# EAGLE design AnalogShield-03 (EAGLE 7.2.0)
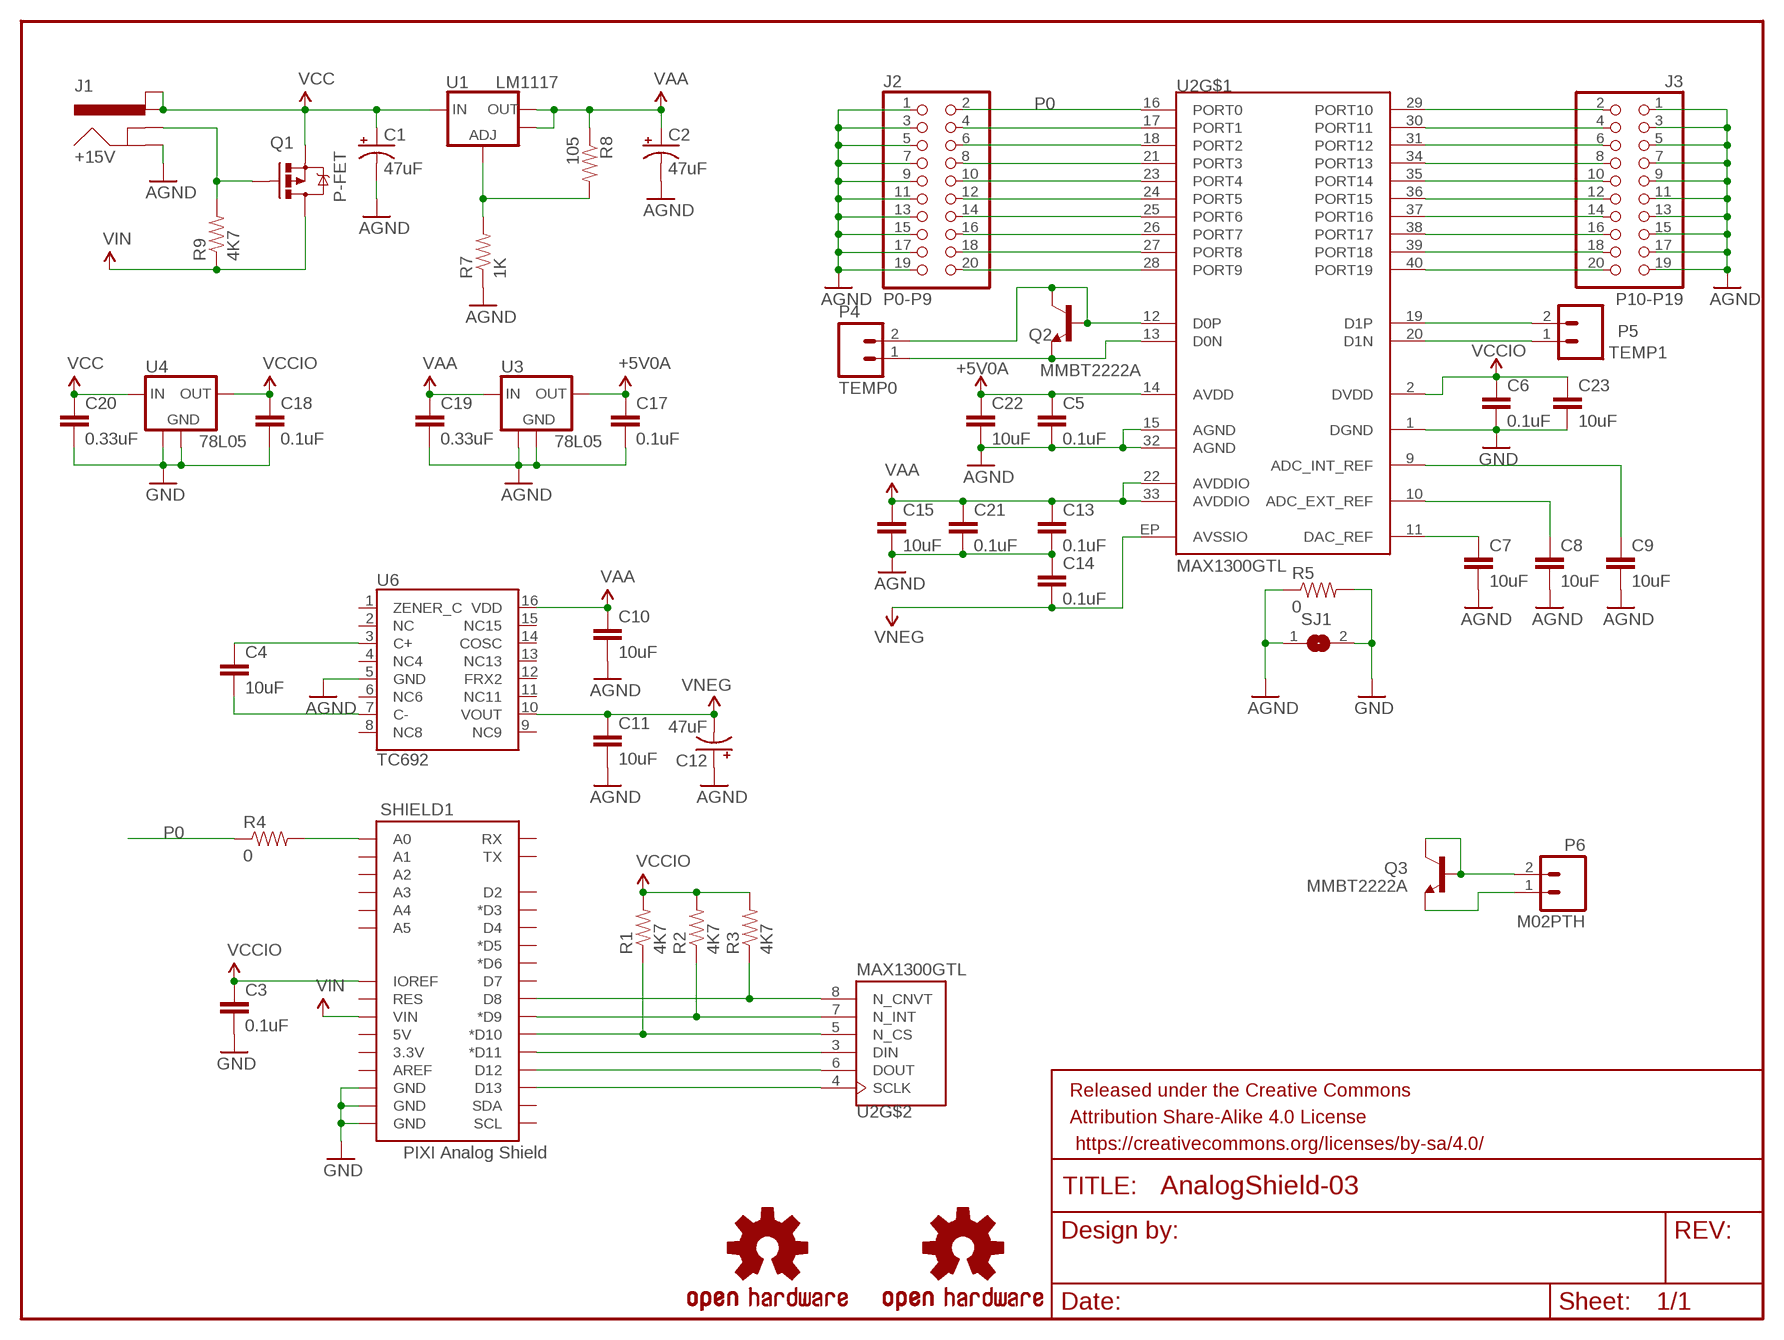
[diagram p0: schematic, sheet 1]

## Parts
C1  47uF  47UF-50V-20%(ELECT)  [PANASONIC_D]
C2  47uF  47UF-50V-20%(ELECT)  [PANASONIC_D]
C3  0.1uF  0.1UF-25V(+80/-20%)(0603)  [0603-CAP]
C4  10uF  10UF-25V-10%(1206)  [1206]
C5  0.1uF  0.1UF-25V(+80/-20%)(0603)  [0603-CAP]
C6  0.1uF  0.1UF-25V(+80/-20%)(0603)  [0603-CAP]
C7  10uF  10UF-25V-10%(1206)  [1206]
C8  10uF  10UF-25V-10%(1206)  [1206]
C9  10uF  10UF-25V-10%(1206)  [1206]
C10  10uF  10UF-25V-10%(1206)  [1206]
C11  10uF  10UF-25V-10%(1206)  [1206]
C12  47uF  47UF-50V-20%(ELECT)  [PANASONIC_D]
C13  0.1uF  0.1UF-25V(+80/-20%)(0603)  [0603-CAP]
C14  0.1uF  0.1UF-25V(+80/-20%)(0603)  [0603-CAP]
C15  10uF  10UF-25V-10%(1206)  [1206]
C17  0.1uF  0.1UF-25V(+80/-20%)(0603)  [0603-CAP]
C18  0.1uF  0.1UF-25V(+80/-20%)(0603)  [0603-CAP]
C19  0.33uF  0.33UF-25V(+20/-20%)(0603)  [0603-CAP]
C20  0.33uF  0.33UF-25V(+20/-20%)(0603)  [0603-CAP]
C21  0.1uF  0.1UF-25V(+80/-20%)(0603)  [0603-CAP]
C22  10uF  10UF-25V-10%(1206)  [1206]
C23  10uF  10UF-25V-10%(1206)  [1206]
FRAME1  FRAME-LETTER  [CREATIVE_COMMONS]
J1  +15V  POWER_JACKSMD  [POWER_JACK_SMD]
J2  P0-P9  PINHD-2X10_SMD  [2X10_SMD]
J3  P10-P19  PINHD-2X10_SMD  [2X10_SMD]
LOGO1  OSHW-LOGOS  [OSHW-LOGO-S]
LOGO2  OSHW-LOGOS  [OSHW-LOGO-S]
P4  TEMP0  M02PTH  [1X02]
P5  TEMP1  M024UCON-15767  [JST-2-SMD-VERT]
P6  M02PTH  [1X02]
Q1  P-FET  [SOT23-3]
Q2  MMBT2222A  TRANSISTOR_NPNMMBT2222A  [SOT23-3]
Q3  MMBT2222A  TRANSISTOR_NPNMMBT2222A  [SOT23-3]
R1  4K7  4.7KOHM1/10W1%(0603)  [0603]
R2  4K7  4.7KOHM1/10W1%(0603)  [0603]
R3  4K7  4.7KOHM1/10W1%(0603)  [0603]
R4  0  0OHM-1/10W-5%(0603)  [0603]
R5  0  0OHM-1/10W-5%(0603)  [0603]
R7  1K  1KOHM-1/10W-1%(0603)  [0603-RES]
R8  105  105OHM-1/10W-1%(0603)  [0603-RES]
R9  4K7  4.7KOHM1/10W1%(0603)  [0603]
SHIELD1  PIXI Analog Shield  ARDUINO_R3_SHIELDNOLABELS  [UNO_R3_SHIELD_NOLABELS]
SJ1  SJ  [SJ]
U1  LM1117  V_REG_LM1117SOT223  [SOT223]
U2  MAX1300GTL  MAX11300GTL  [QFN50P600X600X75-41]
U3  78L05  [SOT89]
U4  78L05  [SOT89]
U6  TC692  TC962COE  [SO16L]

## Nets
+5V0A: C5.1 C17.1 C22.1 U2.14(AVDD) U3.1(OUT)
ADJ: R7.2 R8.2 U1.1(ADJ)
AGND: C1.- C2.- C5.2 C7.2 C8.2 C9.2 C10.2 C11.2 C12.+ C13.2 C14.1 C15.2 C17.2 C19.2 C21.2 C22.2 J1.GND J2.1 J2.3 J2.5 J2.7 J2.9 J2.11 J2.13 J2.15 J2.17 J2.19 J3.1 J3.3 J3.5 J3.7 J3.9 J3.11 J3.13 J3.15 J3.17 J3.19 R5.1 R7.1 SJ1.1 U2.15(AGND) U2.32(AGND) U3.2(GND) U3.4(GND) U6.5(GND)
C+: C4.1 U6.3(C+)
C-: C4.2 U6.7(C-)
DIN: SHIELD1.D11(*D11) U2.3(DIN)
DOUT: SHIELD1.D12 U2.6(DOUT)
GND: C3.2 C6.2 C18.2 C20.2 C23.2 R5.2 SHIELD1.GND@0(GND) SHIELD1.GND@1(GND) SHIELD1.GND@2(GND) SJ1.2 U2.1(DGND) U4.2(GND) U4.4(GND)
N$4: R2.1 SHIELD1.D9(*D9) U2.7(N_INT)
N$5: R1.1 SHIELD1.D10(*D10) U2.5(N_CS)
N$8: SHIELD1.D13 U2.4(SCLK)
N$10: J2.4 U2.17(PORT1)
N$11: J2.6 U2.18(PORT2)
N$12: J2.8 U2.21(PORT3)
N$13: J2.10 U2.23(PORT4)
N$14: J2.12 U2.24(PORT5)
N$15: J2.14 U2.25(PORT6)
N$16: J2.16 U2.26(PORT7)
N$17: J2.18 U2.27(PORT8)
N$18: J2.20 U2.28(PORT9)
N$19: J3.2 U2.29(PORT10)
N$20: J3.4 U2.30(PORT11)
N$21: J3.6 U2.31(PORT12)
N$22: J3.8 U2.34(PORT13)
N$23: J3.10 U2.35(PORT14)
N$24: J3.12 U2.36(PORT15)
N$25: J3.14 U2.37(PORT16)
N$26: J3.16 U2.38(PORT17)
N$27: J3.18 U2.39(PORT18)
N$28: J3.20 U2.40(PORT19)
N$29: P6.2 Q3.1(B) Q3.3(C)
N$30: P6.1 Q3.2(E)
N$31: P4.1 Q2.2(E) U2.13(D0N)
N$32: P4.2 Q2.1(B) Q2.3(C) U2.12(D0P)
N$33: P5.1 U2.20(D1N)
N$34: P5.2 U2.19(D1P)
N$36: C7.1 U2.11(DAC_REF)
N$37: J1.P$4(GNDBREAK) Q1.1(G) R9.2
N$38: C8.1 U2.10(ADC_EXT_REF)
N$39: R4.2 SHIELD1.A0
N$43: C9.1 U2.9(ADC_INT_REF)
N_CNVT: R3.1 SHIELD1.D8 U2.8(N_CNVT)
P0: J2.2 R4.1 U2.16(PORT0)
VAA: C2.+ C10.1 C13.1 C15.1 C19.1 C21.1 R8.1 U1.2(OUT) U1.4(OUT) U2.22(AVDDIO) U2.33(AVDDIO) U3.3(IN) U6.16(VDD)
VCC: C1.+ C20.1 J1.VIN0$1(PWR) J1.VIN0$2(PWR1) Q1.2(S) U1.3(IN) U4.3(IN)
VCCIO: C3.1 C6.1 C18.1 C23.1 R1.2 R2.2 R3.2 SHIELD1.IOREF U2.2(DVDD) U4.1(OUT)
VIN: Q1.3(D) R9.1 SHIELD1.VIN
VNEG: C11.1 C12.- C14.2 U2.EP(AVSSIO) U6.10(VOUT)
Unconnected: SHIELD1.3.3V SHIELD1.5V SHIELD1.A1 SHIELD1.A2 SHIELD1.A3 SHIELD1.A4 SHIELD1.A5 SHIELD1.AREF SHIELD1.D2 SHIELD1.D3(*D3) SHIELD1.D4 SHIELD1.D5(*D5) SHIELD1.D6(*D6) SHIELD1.D7 SHIELD1.RES SHIELD1.RX SHIELD1.SCL SHIELD1.SDA SHIELD1.TX U6.1(ZENER_C) U6.2(NC) U6.4(NC4) U6.6(NC6) U6.8(NC8) U6.9(NC9) U6.11(NC11) U6.12(FRX2) U6.13(NC13) U6.14(COSC) U6.15(NC15)

## Library data of the parts
C1 C2 C12 = SparkFun-Capacitors:47UF-50V-20%(ELECT): CAP-10547; MFR1: Panasonic; MFR1PN: EEE-FPC470UAR; PROD_ID: CAP-10547
C3 C5 C6 C13 C14 C17 C18 C21 = SparkFun-Capacitors:0.1UF-25V(+80/-20%)(0603): CAP-00810 Ceramic Standard decoupling cap; PROD_ID: CAP-00810
C4 C7-C11 C15 C22 C23 = AnalogShield:10UF-25V-10%(1206): 10uF Ceramic; MFR1: Taiyo Yuden; MFR1PN: TMK316B7106KL-TD; MFR2: Samsung; MFR2PN: CL31B106KAHNNNE
C19 C20 = AnalogShield:0.33UF-25V(+20/-20%)(0603): Ceramic Standard decoupling cap
FRAME1 = SparkFun-Aesthetics:FRAME-LETTER: Schematic Frame Standard 8.5x11 US Letter frame
J1 = AnalogShield:POWER_JACK: Power Jack This is the standard 5.5mm barrel jack for power. The PTH is the most common, proven, reliable, footprint. The Slot footprint only works if the mill layer is transmitted to the PCB fab house so be warned. Mating wall wart : TOL-00298 (and others); MFR1: Adam Tech; MFR1PN: ADC-028-01; MFR2: Cui; MFR2PN: PJ-002AH-SMT-TR; MFR3: Sparkfun; MFR3PN: PRT-12748; PROD_ID: CONN-08106; VALUE: 5.5x2.1mm Barrel
J2 J3 = AnalogShield:PINHD-2X10: PIN HEADER; MFR1: Molex; MFR1PN: 15912200
LOGO1 LOGO2 = SparkFun-Aesthetics:OSHW-LOGO: Open Source Hardware Logo This logo indicates the piece of hardware it is found on incorporates a OSHW license and/or adheres to the definition of open source hardware found here: http://freedomdefined.org/OSHW
P4 P6 = SparkFun-Connectors:M02: Standard 2-pin 0.1" header. Use with - straight break away headers ( PRT-00116) - right angle break away headers (PRT-00553) - swiss pins (PRT-00743) - machine pins (PRT-00117) - female headers (PRT-00115) Molex polarized connector foot print use with: PRT-08233 with associated crimp pins and housings. 2.54_SCREWTERM for use with PRT-10571. 3.5mm Screw Terminal footprints for PRT-08084 5mm Screw Terminal footprints for use with PRT-08432
P5 = AnalogShield:M02: Standard 2-pin 0.1" header. Use with - straight break away headers ( PRT-00116) - right angle break away headers (PRT-00553) - swiss pins (PRT-00743) - machine pins (PRT-00117) - female headers (PRT-00115) Molex polarized connector foot print use with: PRT-08233 with associated crimp pins and housings. 2.54_SCREWTERM for use with PRT-10571. 3.5mm Screw Terminal footprints for PRT-08084 5mm Screw Terminal footprints for use with PRT-08432; MFR1: JST; MFR1PN: B2B-PH-SM4-TB
Q1 = AnalogShield:P-FET: Generic PMOSFET IRLML2244 - TRANS-11153 (SOT-23 -20V -4.3A) (1.Gate 2.Source 3.Drain) FQP27P06 - COM-10349 <http://www.sparkfun.com/products/10349> (TO-220 -60V -27A) (1.Gate 2.Source 3.Drain); MFR1: International Rectifier; MFR1PN: IRLML2244; PROD_ID: TRANS-08285
Q2 Q3 = SparkFun-DiscreteSemi:TRANSISTOR_NPN: Generic NPN BJT MMBT2222A - TRANS-08049 (SOT-23, 1A 40V) MPSA42 - TRANS-09116 (SOT-23, 500mA 300V) MMBT5088LT1G - TRANS-11160 (SOT-23, 50 mA 30V) BC547 - COM-08928 <http://www.sparkfun.com/products/8928> (TO-92 45V 100mA) (1.Collector 2.Base 3.Emitter) 2N3904 - COM-00521 <http://www.sparkfun.com/products/521> (TO-92 40V 200mA) (1.Emitter 2.Base 3.Collector) P2N2222A - COM-12852 <http://www.sparkfun.com/products/12852> (TO-92 40V 600mA) (1.Collector 2.Base 3.Emitter); MFR1: NXP; MFR1PN: MMBT3904; MFR2: ON Semi; MFR2PN: MMBT2222A; PROD_ID: TRANS-08049
R1-R3 R9 = SparkFun-Resistors:4.7KOHM1/10W1%(0603): RES-07857; PROD_ID: RES-07857
R4 R5 = SparkFun-Resistors:0OHM-1/10W-5%(0603): RES-08609; PROD_ID: RES-08609
R7 = SparkFun-Resistors:1KOHM-1/10W-1%(0603): RES-07856; PROD_ID: RES-07856
R8 = SparkFun-Resistors:105OHM-1/10W-1%(0603): RES-10751; PROD_ID: RES-10751
SHIELD1 = AnalogShield:ARDUINO_R3_SHIELD: Shield form compatible with the Arduino Uno R3.
SJ1 = jumper:SJ: SMD solder JUMPER
U1 = AnalogShield:V_REG_LM1117: Voltage Regulator LM1117 Standard adjustable voltage regulator but in SMD form. Spark Fun Electronics SKU : COM-00595; MFR1: ST Micro; MFR1PN: LD1117STR; PROD_ID: VREG-08170
U2 = AnalogShield:MAX11300GTL: PIXI, 20-Port Programmable Mixed-Signal I/O with 12-Bit ADC, 12-Bit DAC, Analog Switches, and GPIO; MFR1: Maxim; MFR1PN: MAX11300GTL+
U3 U4 = AnalogShield:78L05; MFR1: Fairchild; MFR1PN: MC78L05ACH
U6 = AnalogShield:TC962COE: 80mA Charge Pump DC-to-DC Converter; MFR1: Microchip; MFR1PN: TC962COE

## Board
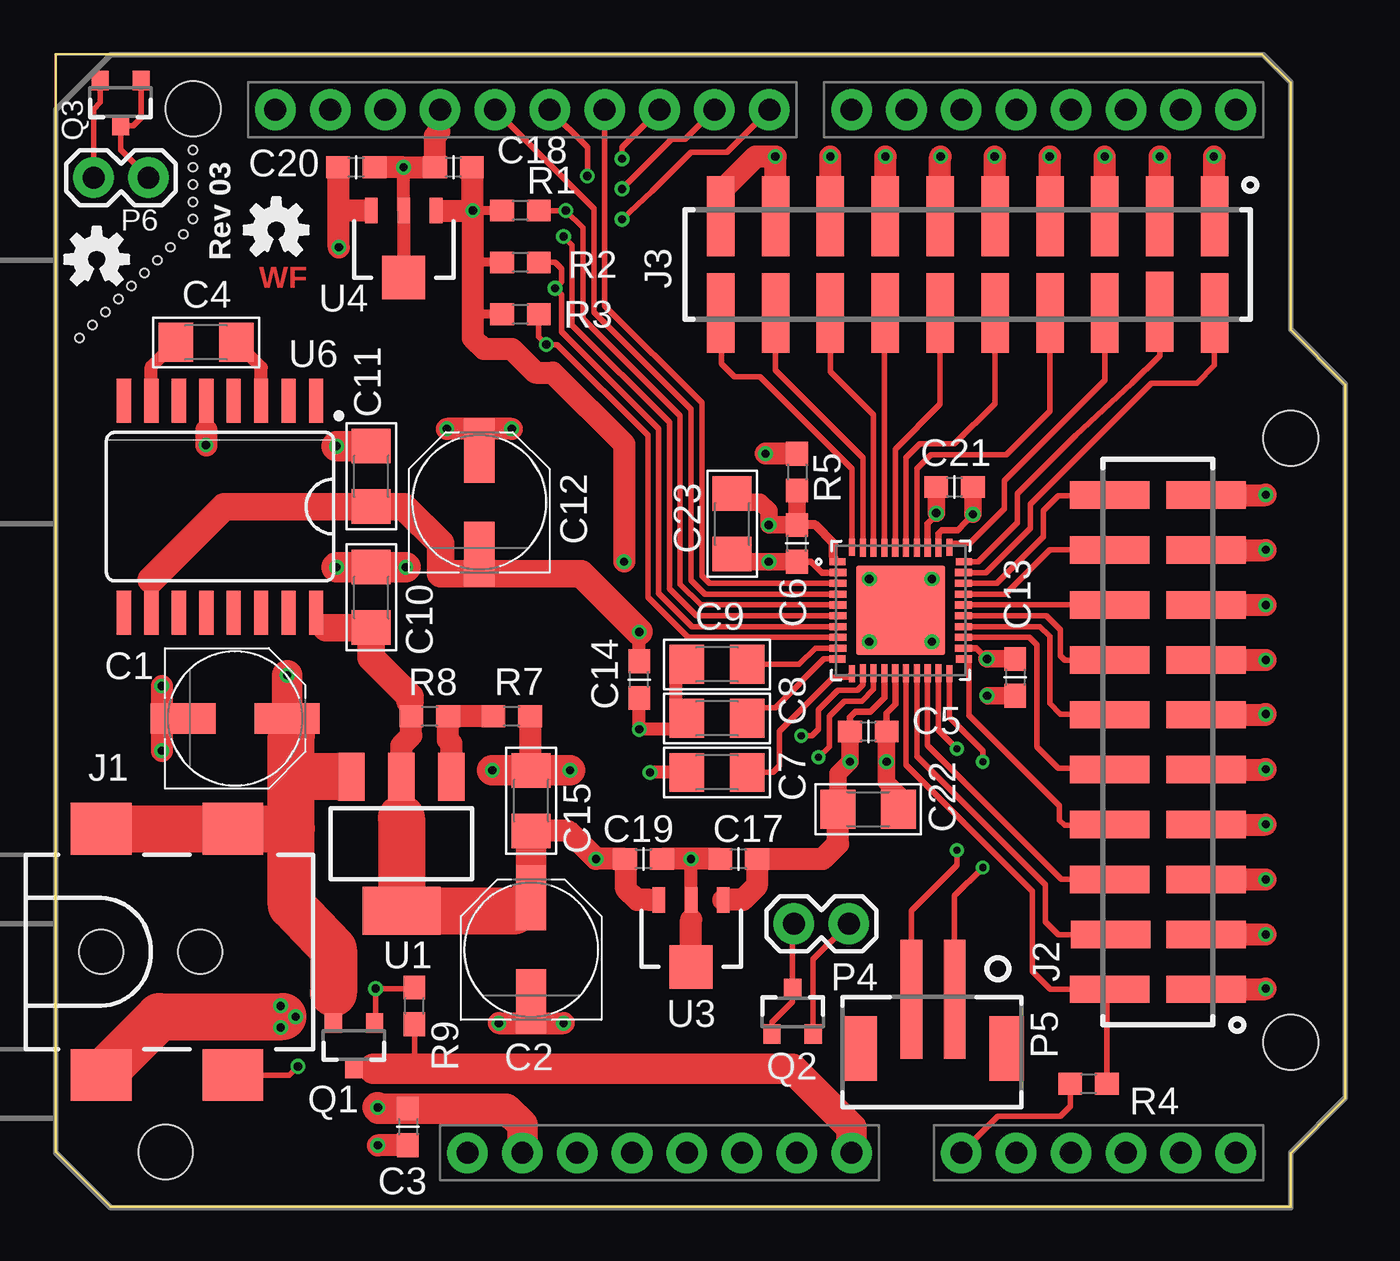
[diagram p1: board, top side]
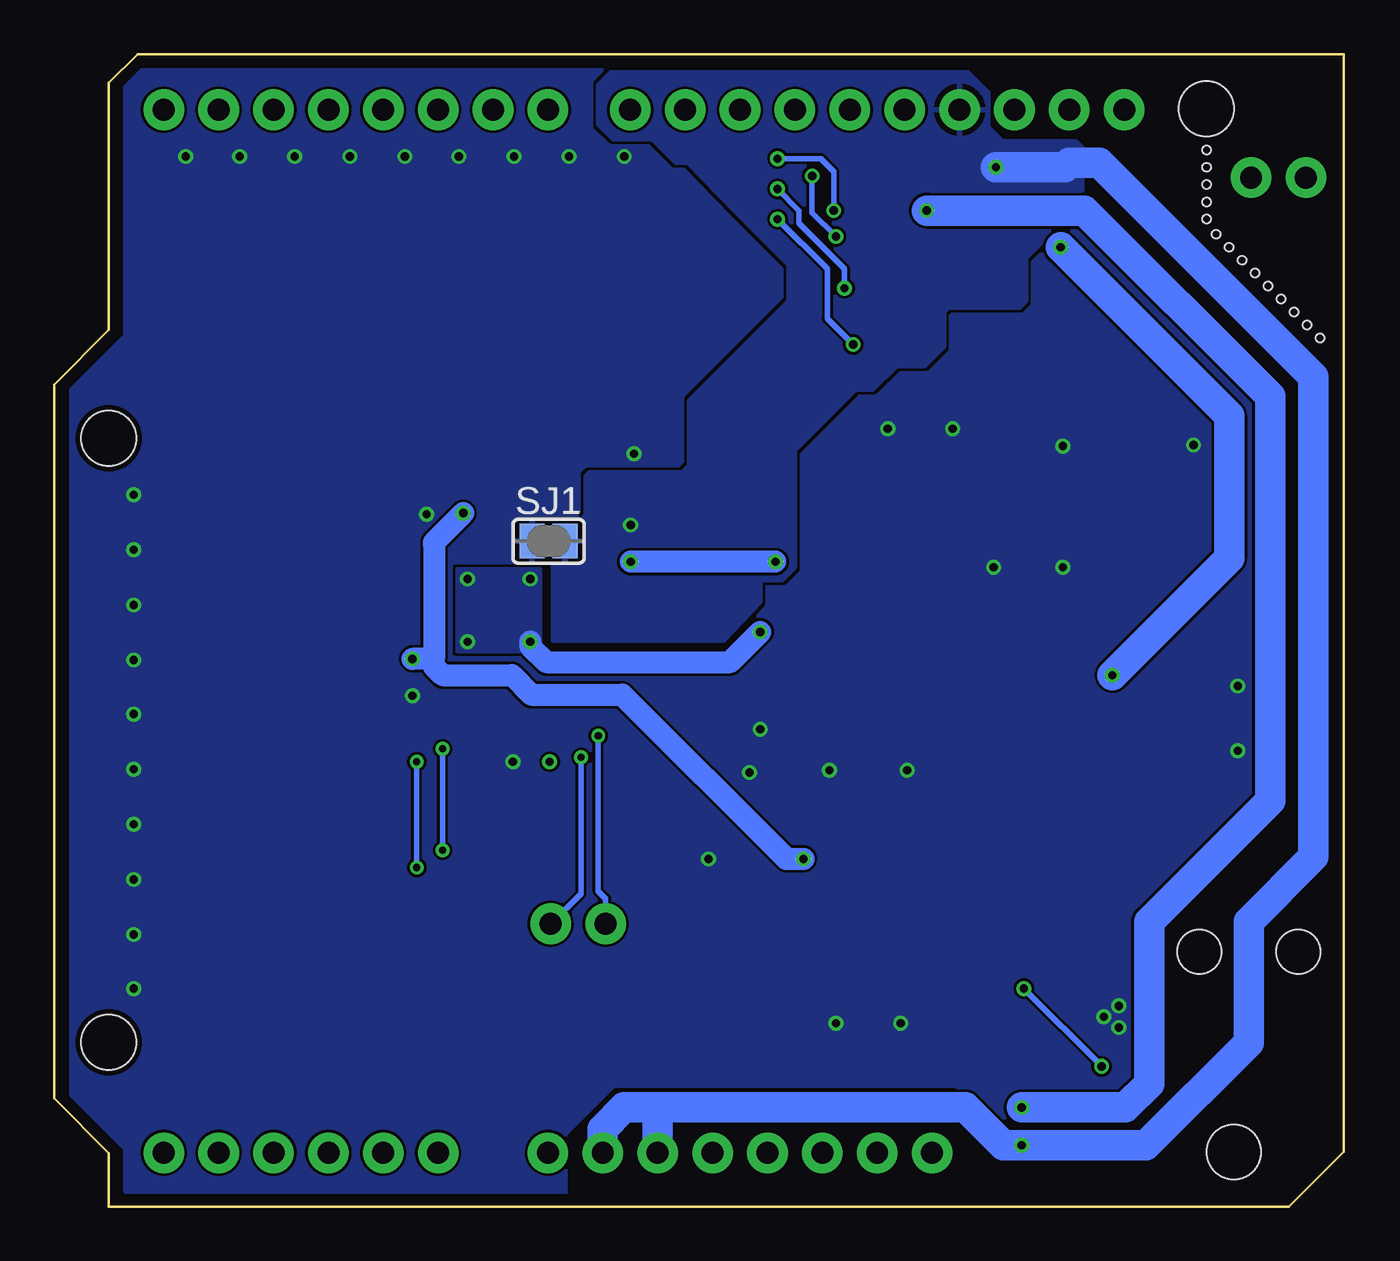
[diagram p2: board, bottom side, seen from below]

Size 59.69 x 53.34 mm. Coordinates in mm from the lower left corner, seen from the top.
Outline: 0,53.3 0,2.54
Outline: 0,2.54 0,53.34 55.82,53.34 57.15,52.01 57.15,40.58 59.69,38.04 59.69,5.02 57.15,2.48 57.15,0 2.54,0 0,2.54
Copper layers (1*16): Top 0.035mm / dielectric 1.5mm / Bottom 0.035mm
Design rules "dirt_cheap_dirty_boards.v1": minimum track width 5mil, minimum drill 12mil, track to track 5mil, track to pad 5mil, pad to pad 5mil, via to via 5mil, smd to smd 0mil, copper to edge 10mil, drill to drill 10mil, minimum pad ring 10mil, minimum via ring 6mil, stop-mask expansion 2mil, vias tented up to drill 25mil, thermal gap 10mil
Holes 2.54 mm at 57.15,35.56 57.15,7.62 6.35,50.8
Holes 2.5 mm at 5.08,2.54
Holes 0.38 mm at 6.35,48.9 6.35,48.1 6.35,47.3 6.35,46.5 6.35,45.7 5.9,45 5.3,44.4 4.7,43.8 4.1,43.2 3.5,42.6 2.9,42 2.3,41.4 1.7,40.8 1.1,40.2

### Footprints (pad centres in the part's own frame; a part is rotated, then mirrored left to right if it is on the bottom)
PANASONIC_D = smd 3 x 1.4: + 2.4,0; - -2.4,0
0603-CAP = smd 1.1 x 1: 1 -0.85,0; 2 0.85,0
1206 = smd 1.6 x 1.8: 1 -1.4,0; 2 1.4,0
POWER_JACK_SMD = smd 2.8 x 2.4: GND 0,-5.7; P$4 6.1,-5.7; VIN0$1 0,5.7; VIN0$2 6.1,5.7 | hole 2.032: 0,0; 4.572,0
2X10_SMD = smd 1.27 x 3.68: 1 11.43,2.235 | smd 1.27 x 3.683: 2 11.43,-2.235; 3 8.89,2.235; 4 8.89,-2.184; 5 6.35,2.235; 6 6.35,-2.235; 7 3.81,2.235; 8 3.81,-2.235; 9 1.27,2.235; 10 1.27,-2.235; 11 -1.27,2.235; 12 -1.27,-2.235; 13 -3.81,2.235; 14 -3.81,-2.235; 15 -6.35,2.235; 16 -6.35,-2.235; 17 -8.89,2.235; 18 -8.89,-2.235; 19 -11.43,2.235; 20 -11.43,-2.235
1X02 = drill 1.016 pad 1.88: 1 0,0; 2 2.54,0
JST-2-SMD-VERT = smd 1 x 5.5: 1 -1,-2; 2 1,-2 | smd 1.6 x 3: P$1 -3.4,0.27; P$2 3.4,0.27
SOT23-3 = smd 0.8 x 0.9: 1 -0.95,-1; 2 0.95,-1; 3 0,1.1
0603 = smd 1.1 x 1: 1 -0.85,0; 2 0.85,0
0603-RES = smd 1.1 x 1: 1 -0.85,0; 2 0.85,0
UNO_R3_SHIELD_NOLABELS = drill 1.016 pad 1.88: 3.3V 50.8,26.67; 5V 50.8,29.21; A0 50.8,41.91; A1 50.8,44.45; A2 50.8,46.99; A3 50.8,49.53; A4 50.8,52.07; A5 50.8,54.61; AREF 2.54,15.24; D2 2.54,49.53; D3 2.54,46.99; D4 2.54,44.45; D5 2.54,41.91; D6 2.54,39.37; D7 2.54,36.83; D8 2.54,33.02; D9 2.54,30.48; D10 2.54,27.94; D11 2.54,25.4; D12 2.54,22.86; D13 2.54,20.32; GND@0 50.8,31.75; GND@1 50.8,34.29; GND@2 2.54,17.78; IOREF 50.8,21.59; NC 50.8,19.05; RES 50.8,24.13; RX 2.54,54.61; SCL 2.54,10.16; SDA 2.54,12.7; TX 2.54,52.07; VIN 50.8,36.83
SJ = smd 1.168 x 1.6: 1 -0.762,0; 2 0.762,0
SOT223 = smd 1.219 x 2.235: 1 -2.311,-3.099; 2 0,-3.099; 3 2.311,-3.099 | smd 3.6 x 2.2: 4 0,3.099
QFN50P600X600X75-41 = smd 0.75 x 0.297: 1 -2.925,2.25; 10 -2.925,-2.25; 21 2.925,-2.25; 30 2.925,2.25 | smd 0.8 x 0.297: 2 -2.9,1.75; 3 -2.9,1.25; 4 -2.9,0.75; 5 -2.9,0.25; 6 -2.9,-0.25; 7 -2.9,-0.75; 8 -2.9,-1.25; 9 -2.9,-1.75; 22 2.9,-1.75; 23 2.9,-1.25; 24 2.9,-0.75; 25 2.9,-0.25; 26 2.9,0.25; 27 2.9,0.75; 28 2.9,1.25; 29 2.9,1.75 | smd 0.297 x 0.75: 11 -2.25,-2.925; 20 2.25,-2.925; 31 2.25,2.925; 40 -2.25,2.925 | smd 0.297 x 0.8: 12 -1.75,-2.9; 13 -1.25,-2.9; 14 -0.75,-2.9; 15 -0.25,-2.9; 16 0.25,-2.9; 17 0.75,-2.9; 18 1.25,-2.9; 19 1.75,-2.9; 32 1.75,2.9; 33 1.25,2.9; 34 0.75,2.9; 35 0.25,2.9; 36 -0.25,2.9; 37 -0.75,2.9; 38 -1.25,2.9; 39 -1.75,2.9 | smd 4.13 x 4.13: EP 0,0
SOT89 = smd 0.58 x 1.2: 1 -1.5,-1.8; 2 0,-1.8; 3 1.5,-1.8 | smd 2 x 2: 4 0,1.3
SO16L = smd 0.66 x 2.032: 1 -4.445,-4.902; 2 -3.175,-4.902; 3 -1.905,-4.902; 4 -0.635,-4.902; 5 0.635,-4.902; 6 1.905,-4.902; 7 3.175,-4.902; 8 4.445,-4.902; 9 4.445,4.902; 10 3.175,4.902; 11 1.905,4.902; 12 0.635,4.902; 13 -0.635,4.902; 14 -1.905,4.902; 15 -3.175,4.902; 16 -4.445,4.902

### Placement (x,y rotation side)
C1  8.3,22.6 0 top
C2  22,11.9 90 top
C3  16.3,3.7 270 top
C4  6.95,40 180 top
C5  37.6,22 0 top
C6  34.3,30.7 90 top
C7  30.6,20.1 180 top
C8  30.6,22.6 180 top
C9  30.6,25.1 180 top
C10  14.6,28.2 90 top
C11  14.6,33.8 90 top
C12  19.6,32.6 90 top
C13  44.4,24.5 270 top
C14  27,24.4 90 top
C15  22,18.8 90 top
C17  31.6,16.1 180 top
C18  18.4,48.1 180 top
C19  27.2,16.1 0 top
C20  13.9,48.1 0 top
C21  41.6,33.3 0 top
C22  37.6,18.4 0 top
C23  31.3,31.6 90 top
FRAME1  0.5,-7.7 0 top  (outside the outline)
J1  2.1,11.8 0 top
J2  51,21.5 270 top
J3  42.2,43.6 0 top
LOGO1  10.2,45.2 0 top
LOGO2  1.89,43.84 0 top
P4  36.7,13.1 180 top
P5  40.6,7.6 180 top
P6  1.75,47.62 0 top
Q1  13.8,7.5 180 top
Q2  34.1,9 0 top
Q3  3,51.12 180 top
R1  21.5,46.1 180 top
R2  21.5,43.7 180 top
R3  21.5,41.3 180 top
R4  47.8,5.7 180 top
R5  34.3,34 270 top
R7  21.1,22.7 180 top
R8  17.3,22.7 0 top
R9  16.6,9.3 90 top
SHIELD1  0,53.3 270 top
SJ1  36.8,30.8 0 bottom
U1  16,16.8 180 top
U2  39.1,27.6 0 top
U3  29.4,12.4 180 top
U4  16.1,44.3 180 top
U6  7.6,32.4 180 top

### Tracks (layer width: path | path; a pad name or v marks a point on that pad's centre or on a via)
+5V0A  (via drill 0.38)
  Top 0.297: 37.7,22.9 38.35,23.55 U2.14
  Top 0.305: C5.1 36.75,22.65 37,22.9 37.7,22.9
  Top 0.813: C5.1 v36.75,20.6 36.2,20.05 C22.1
  Top 1.016: U3.1 31.8,14.2 32.45,14.85 C17.1 35.5,16.1 36.2,16.8 C22.1
ADJ
  Top 1.016: R7.2 R8.2 18.15,21.6 18.31,21.44 U1.1
AGND  (via drill 0.38)
  Top 0.254: 10.5,8.8 10.4,8.7 v10.4,8.3 | 43.15,23.65 v43.1,23.65 | 6.96,35.23 v6.95,35.25
  Top 0.297: 41,31.3 40.85,31.15 U2.32 | U2.15 38.85,23.25
  Top 0.3: 41,31.3 41.75,31.3
  Top 0.305: 41.75,31.3 v42.45,32.05 | C5.2 38.45,22.85 38.85,23.25
  Top 0.61: v29.4,16.1 U3.2 29.4,13.3 | C14.1 v27,22.1 28.7,22.1 C8.2 28.7,22.6 28.7,24.8 29.2,24.8 C9.2 | C7.2 v27.5,20.1 | U6.5 6.96,35.94
  Top 0.813: C13.2 43.15,23.65 | C21.2 v42.45,32.05 | C22.2 39,19.1 38.45,19.65 v38.45,20.6 C5.2
  Top 1.016: J3.17 v33.31,48.59 v33.3,48.6 32.4,48.6 30.77,46.97 J3.19 | J3.15 v35.85,48.6 | J3.13 v38.39,48.59 v38.4,48.6 | J3.11 40.93,48.58 v40.95,48.6 | J3.9 43.47,48.58 v43.45,48.6 | J3.7 v46.01,48.59 v46,48.6 | J3.5 v48.55,48.6 | J3.3 v51.09,48.59 v51.1,48.6 | J3.1 53.63,48.57 v53.6,48.6 | J2.3 v55.99,12.61 v56,12.6 | J2.1 55.97,10.07 v56,10.1 | J2.5 v56,15.15 | J2.7 v55.99,17.69 v56,17.7 | J2.9 55.98,20.23 v56,20.25 | J2.11 55.97,22.77 v56,22.8 | J2.13 v55.99,25.31 v56,25.3 | J2.15 v56,27.85 | J2.17 v55.99,30.39 v56,30.4 | J2.19 55.98,32.93 v56,32.95 | C17.2 v29.4,16.1 C19.2 | U3.4 29.4,13.3 | C2.- 22,8.5 | 22,8.5 v23.5,8.5 | v20.5,8.5 22,8.5 | R7.1 21.95,20.25 C15.2 | 6.96,35.94 6.96,35.23 | R5.1 v32.85,34.85 | C12.+ 19.6,36 | 19.6,36 v18.1,36 | v21.1,36 19.6,36 | C1.- 4.9,22.6 | 4.9,22.6 v4.9,21.1 | v4.9,24.1 4.9,22.6
  Top 1.422: v23.8,20.2 C15.2 v20.2,20.2 | C11.2 v13,35.2 | v13,29.6 C10.2 v16.2,29.6
  Top 2.184: J1.GND 4.8,8.8 10.5,8.8
  other vias: 10.4,9.3 11.1,8.8
  pour Bottom (rank 3): 56.4,0.7 56.4,2.7 58.9,5.2 58.9,5.6 58.9,37.8 56.9,39.8 56.6,40.1 56.4,40.3 56.4,51.8 55.6,52.6 2.8,52.6 0.7,50.5 0.7,2.8 2.8,0.7
C+
  Top 0.61: U6.3 9.51,38.84 C4.1
C-
  Top 0.61: U6.7 4.42,38.88 C4.2
DIN
  Top 0.254: U2.3 30.25,28.85 29.9,29.2 29.9,37.2 25.4,41.7 SHIELD1.D11
DOUT  (via drill 0.38)
  Top 0.254: U2.6 29.65,27.35 28.4,28.6 28.4,36.3 23.9,40.8 23.9,44.5 v23.5,44.9 | v24.6,47.7 24.6,49.02 SHIELD1.D12
  Bottom 0.254: v23.5,44.9 24.6,46 v24.6,47.7
GND  (via drill 0.38)
  Top 0.254: U2.1 36.05,29.85 36,29.9 36,30.05
  Top 0.406: C6.2 35.15,31.55 36,30.7 36,30.05
  Top 0.61: v16.1,48.1 U4.2 U4.4
  Top 0.813: C23.2 31.7,32.6 32.6,32.6 33,32.2 v33,31.55 C6.2 R5.2
  Top 1.016: C3.2 v14.9,2.85 | C20.2 v16.1,48.1 C18.2 17.55,49.55 17.75,49.75 17.75,50.75 17.8,50.7
  Bottom 0.254: SHIELD1.GND@1
  Bottom 1.422: SHIELD1.GND@1 34.3,3.6 33.3,4.6 31.8,4.6 | 31.8,4.6 31.75,4.55 SHIELD1.GND@0 | 31.8,4.6 17.5,4.6 15.75,2.85 v14.9,2.85 9.15,2.85 4.4,7.6 4.4,13.2 1.4,16.2 1.4,38.4 11.3,48.3 12.7,48.3 12.9,48.1 v16.1,48.1
  pour Bottom: 36.6,26.2 36.6,30.5 35.1,32 35.1,33.8 34.9,34 30.6,34 30.3,34.3 30.3,37.3 25.7,41.9 25.7,43.6 28.1,46 29.65,47.6 30.35,48.3 30.9,48.3 32,49.4 33.8,49.4 34.5,50.1 34.5,51.9 33.9,52.5 17.4,52.5 16.45,51.55 16.45,49.95 15.8,49.3 12.4,49.3 12.1,49 12.1,46.5 14.7,43.9 14.7,41.9 15,41.6 18.3,41.6 18.5,41.4 18.5,39.8 19.4,38.9 20.7,38.9 21.8,37.8 22.6,37.8 25.4,35 25.4,29.6 26,29 27,29 27,28 28.7,26.2
N$2
  cutout Bottom: 35.8,0.7 35.8,3.3 35,4.1 33.7,5.4 18,5.4 18,0.7
N$3
  Bottom 0.406: 36.4,30.8 37.4,30.8
N$4  (via drill 0.38)
  Top 0.254: U2.7 29.45,26.85 27.9,28.4 27.9,36 23.4,40.5 23.4,42.2 v23.1,42.5 23.4,42.8 23.4,43.4 23.1,43.7 R2.1 | v26.2,47.1 28.5,49.4 29.12,49.4 SHIELD1.D9
  Bottom 0.254: v26.2,47.1 25.2,46.1 25.2,45.5 23.1,43.4 v23.1,42.5
N$5  (via drill 0.38)
  Top 0.254: U2.5 29.85,27.85 28.9,28.8 28.9,36.6 24.4,41.1 24.4,45.3 v23.6,46.1 R1.1 | v26.2,48.5 26.2,49.02 SHIELD1.D10
  Bottom 0.254: v23.6,46.1 23.6,47.9 24.2,48.5 v26.2,48.5
N$8
  Top 0.254: U2.4 30.05,28.35 29.4,29 29.4,36.9 24.9,41.4 24.9,46.18 SHIELD1.D13
N$10
  Top 0.254: U2.17 39.85,20.85 45.8,14.9 45.8,13.2 46.4,12.6 48.81,12.6 J2.4
N$11
  Top 0.254: U2.18 40.35,21.35 46.55,15.15 J2.6
N$12
  Top 0.254: U2.21 42.25,25.35 42.25,22.75 46.45,18.55 46.45,17.9 46.7,17.65 48.73,17.65 J2.8
N$13
  Top 0.254: U2.23 45.05,26.35 45.4,26 45.4,21.3 46.4,20.3 48.7,20.3 J2.10
N$14
  Top 0.254: U2.24 45.55,26.85 46,26.4 46,23.3 46.5,22.8 48.73,22.8 J2.12
N$15
  Top 0.254: U2.25 45.85,27.35 46.5,26.7 46.5,25.5 46.7,25.3 J2.14
N$16
  Top 0.254: U2.26 J2.16
N$17
  Top 0.254: U2.27 43.95,28.35 46,30.4 J2.18
N$18
  Top 0.254: U2.28 43.55,28.85 45.7,31 45.7,32.2 46.4,32.9 48.73,32.9 J2.20
N$19
  Top 0.254: U2.29 43.05,29.35 45.1,31.4 45.1,32.5 50.7,38.1 52.8,38.1 53.63,38.93 J3.2
N$20
  Top 0.254: U2.30 42.7,29.85 44.5,31.65 44.5,33 47.2,35.7 49.8,38.1 51.09,39.39 J3.4
N$21
  Top 0.254: U2.31 41.35,30.7 42.3,30.7 43.9,32.3 43.9,33.6 48.55,38.25 J3.6
N$22
  Top 0.254: U2.34 39.85,34.15 40.5,34.8 44,34.8 46.01,36.81 J3.8
N$23
  Top 0.254: U2.35 39.35,34.65 40,35.3 41.6,35.3 43.47,37.17 J3.10
N$24
  Top 0.254: U2.36 38.85,35.05 40.93,37.13 J3.12
N$25
  Top 0.254: U2.37 38.35,41.33 J3.14
N$26
  Top 0.254: U2.38 37.85,36.65 35.85,38.65 J3.16
N$27
  Top 0.254: U2.39 37.35,34.65 33.3,38.7 J3.18
N$28
  Top 0.254: U2.40 36.85,34.15 32.6,38.4 31.4,38.4 30.8,39 30.8,41.34 J3.20
N$29
  Top 0.254: P6.2 3,48.91 Q3.3 3.57,50.02 3.95,50.4 Q3.1
N$30
  Top 0.254: P6.1 1.75,50.8 2.05,51.1 Q3.2
N$31  (via drill 0.33)
  Top 0.254: U2.13 37.85,23.95 37.3,23.4 36.5,23.4 35.8,22.7 35.8,21.3 v35.3,20.8 | Q2.2 35.05,11.45 P4.1
  Bottom 0.254: v35.3,20.8 35.3,14.5 P4.1
N$32  (via drill 0.33)
  Top 0.254: U2.12 37.35,24.15 37.1,23.9 36.2,23.9 35.3,23 35.3,22.1 35,21.8 v34.5,21.8 | Q2.1 33.15,8.55 34.1,9.5 Q2.3 34.1,13.1 P4.2
  Bottom 0.254: P4.2 34.16,14.26 34.5,14.6 v34.5,21.8
N$33  (via drill 0.33)
  Top 0.254: U2.20 41.35,22.65 42.9,21.1 v42.9,20.6 | P5.1 41.6,14.4 v42.9,15.7
  Bottom 0.254: v42.9,15.7 v42.9,20.6
N$34  (via drill 0.33)
  Top 0.254: v41.7,21.2 40.85,22.05 U2.19 | P5.2 39.6,13.7 41.7,15.8 v41.7,16.5 41.7,16.7
  Bottom 0.254: v41.7,16.5 v41.7,21.2
N$36
  Top 0.254: C7.1 33.2,20.1 33.5,20.4 33.5,22 36,24.5 36.65,24.5 U2.11
N$37  (via drill 0.38)
  Top 0.254: J1.P$4 10.8,6.1 v11.2,6.5 | R9.2 16.55,10.1 v14.8,10.1 14.8,8.55 Q1.1
  Bottom 0.254: v11.2,6.5 v14.8,10.1
N$38
  Top 0.254: U2.10 35.55,25.35 33.3,23.1 32.5,23.1 C8.1
N$39
  Top 0.254: R4.2 46.95,4.65 46.5,4.2 43.61,4.2 SHIELD1.A0
N$43
  Top 0.254: C9.1 34.4,25.1 35.15,25.85 U2.9
N_CNVT  (via drill 0.38)
  Top 0.254: U2.8 29.25,26.35 27.4,28.2 27.4,35.7 23.2,39.9 v22.7,39.9 22.35,40.25 R3.1 | v26.2,45.7 27.6,47 29.4,48.8 31.06,48.8 SHIELD1.D8
  Bottom 0.254: v26.2,45.7 23.9,43.4 23.9,41.1 v22.7,39.9
P0
  Top 0.254: U2.16 39.35,20.45 45.2,14.6 45.2,10.9 46.03,10.07 J2.2 48.65,9.96 R4.1
VAA  (via drill 0.38)
  Top 0.297: 40.35,31.6 40.35,31.1 U2.33 | U2.22 42.6,25.85
  Top 0.305: v43.1,25.35 42.6,25.85 | 40.35,31.6 40.75,32 v40.75,32.1
  Top 0.61: U3.3 27.5,14.2 | U6.16 12.04,26.8 12.5,26.8
  Top 0.813: C13.1 v43.1,25.35 | C21.1 v40.75,32.1
  Top 1.016: 27.5,14.2 26.9,14.2 26.4,14.7 26.4,16.05 C19.1 v25,16.1 23.7,17.4 C15.1 | 16.4,23.4 16.45,23.35 R8.1 16.45,21.8 16,21.35 U1.2 16,18
  Top 1.27: 12.5,26.8 C10.1 14.6,25.4 16.4,23.6 16.4,23.4 | 21.2,13.7 21.2,14 22,14.8
  Top 1.422: C2.+ 22,14.8 C15.1
  Top 2.184: 16,18 U1.4 21.2,13.7
  Bottom 1.016: 42.1,25.35 42.1,30.65 42.1,30.75 v40.75,32.1 | v25,16.1 25.8,16.1 33.4,23.7 37.6,23.7 38.5,24.6 41.7,24.6 42.1,25 42.1,25.35 | 42.1,25.35 v43.1,25.35
VCC  (via drill 0.38)
  Top 0.254: Q1.2 12.85,9.9
  Top 0.61: U4.3 14.2,46.1
  Top 1.016: v13.1,44.4 13.1,46.2 | 13.1,46.2 13.1,48.05 C20.1 | 14.2,46.1 13.2,46.1 13.1,46.2 | 10.9,21.8 C1.+ | 13.2,19.9 U1.3
  Top 1.422: C1.+ v10.7,24.6
  Top 2.184: 10.9,17.5 10.9,19.9 | 10.9,19.9 10.9,21.8 | 13.2,19.9 10.9,19.9 | 12.85,9.9 12.85,11.9 10.9,13.95 10.9,17.5 | J1.VIN0$1 J1.VIN0$2 10.9,17.5
  Bottom 1.422: v10.7,24.6 5.3,30 5.3,36.6 v13.1,44.4
VCCIO  (via drill 0.38)
  Top 0.254: 35.7,29.35 U2.2 | SHIELD1.IOREF
  Top 0.305: C6.1 34.95,29.85 35.45,29.35 35.7,29.35
  Top 0.406: R1.2 v19.3,46.1 | R3.2 19.3,41.3 | R2.2 19.3,43.7
  Top 0.61: U4.1 17.8,46.1
  Top 0.813: C6.1 v33,29.85 31.65,29.85 C23.1 | 19.3,48.05 C18.1
  Top 1.016: v19.3,46.1 19.3,43.7 19.3,41.3 19.3,40.2 19.8,39.7 21.1,39.7 22.2,38.6 23,38.6 26.3,35.3 v26.3,29.85 | v19.3,46.1 19.3,48.05 | 17.8,46.1 v19.3,46.1
  Top 1.422: SHIELD1.IOREF 21.6,3.8 20.85,4.55 C3.1 14.95,4.55 v14.9,4.6
  Bottom 1.016: v26.3,29.85 v33,29.85
  Bottom 1.422: v14.9,4.6 10.1,4.6 9,5.7 9,13.2 3.4,18.8 3.4,37.5 12,46.1 v19.3,46.1
VIN
  Top 0.254: R9.1 16.6,6.7 16.9,6.4 | Q1.3 14.7,6.4
  Top 1.422: 14.7,6.4 16.9,6.4 34.1,6.4 36.83,3.67 SHIELD1.VIN
VNEG  (via drill 0.38)
  Top 0.254: v37.65,26.15 U2.EP
  Top 0.61: C14.2 v27,26.6 | U6.10 4.42,29.02
  Top 1.27: 4.42,29.02 7.8,32.4 C11.1 16.1,32.4 17.8,30.7 17.8,29.3 19.5,29.3 | 19.5,29.3 24.3,29.3 v27,26.6 | C12.- 19.6,29.4 19.5,29.3
  Bottom 1.016: v37.65,26.15 37.65,25.95 36.9,25.2 28.4,25.2 v27,26.6
  other vias: 40.55,26.15 40.55,29.05 37.65,29.05
  pour Bottom (rank 2): 37.2,29.5 37.2,25.7 41,25.7 41,29.5

### Text on the board
Top: WF
tPlace: Rev 03